# Altium schematic sheet Sheet1.SchDoc
size A3
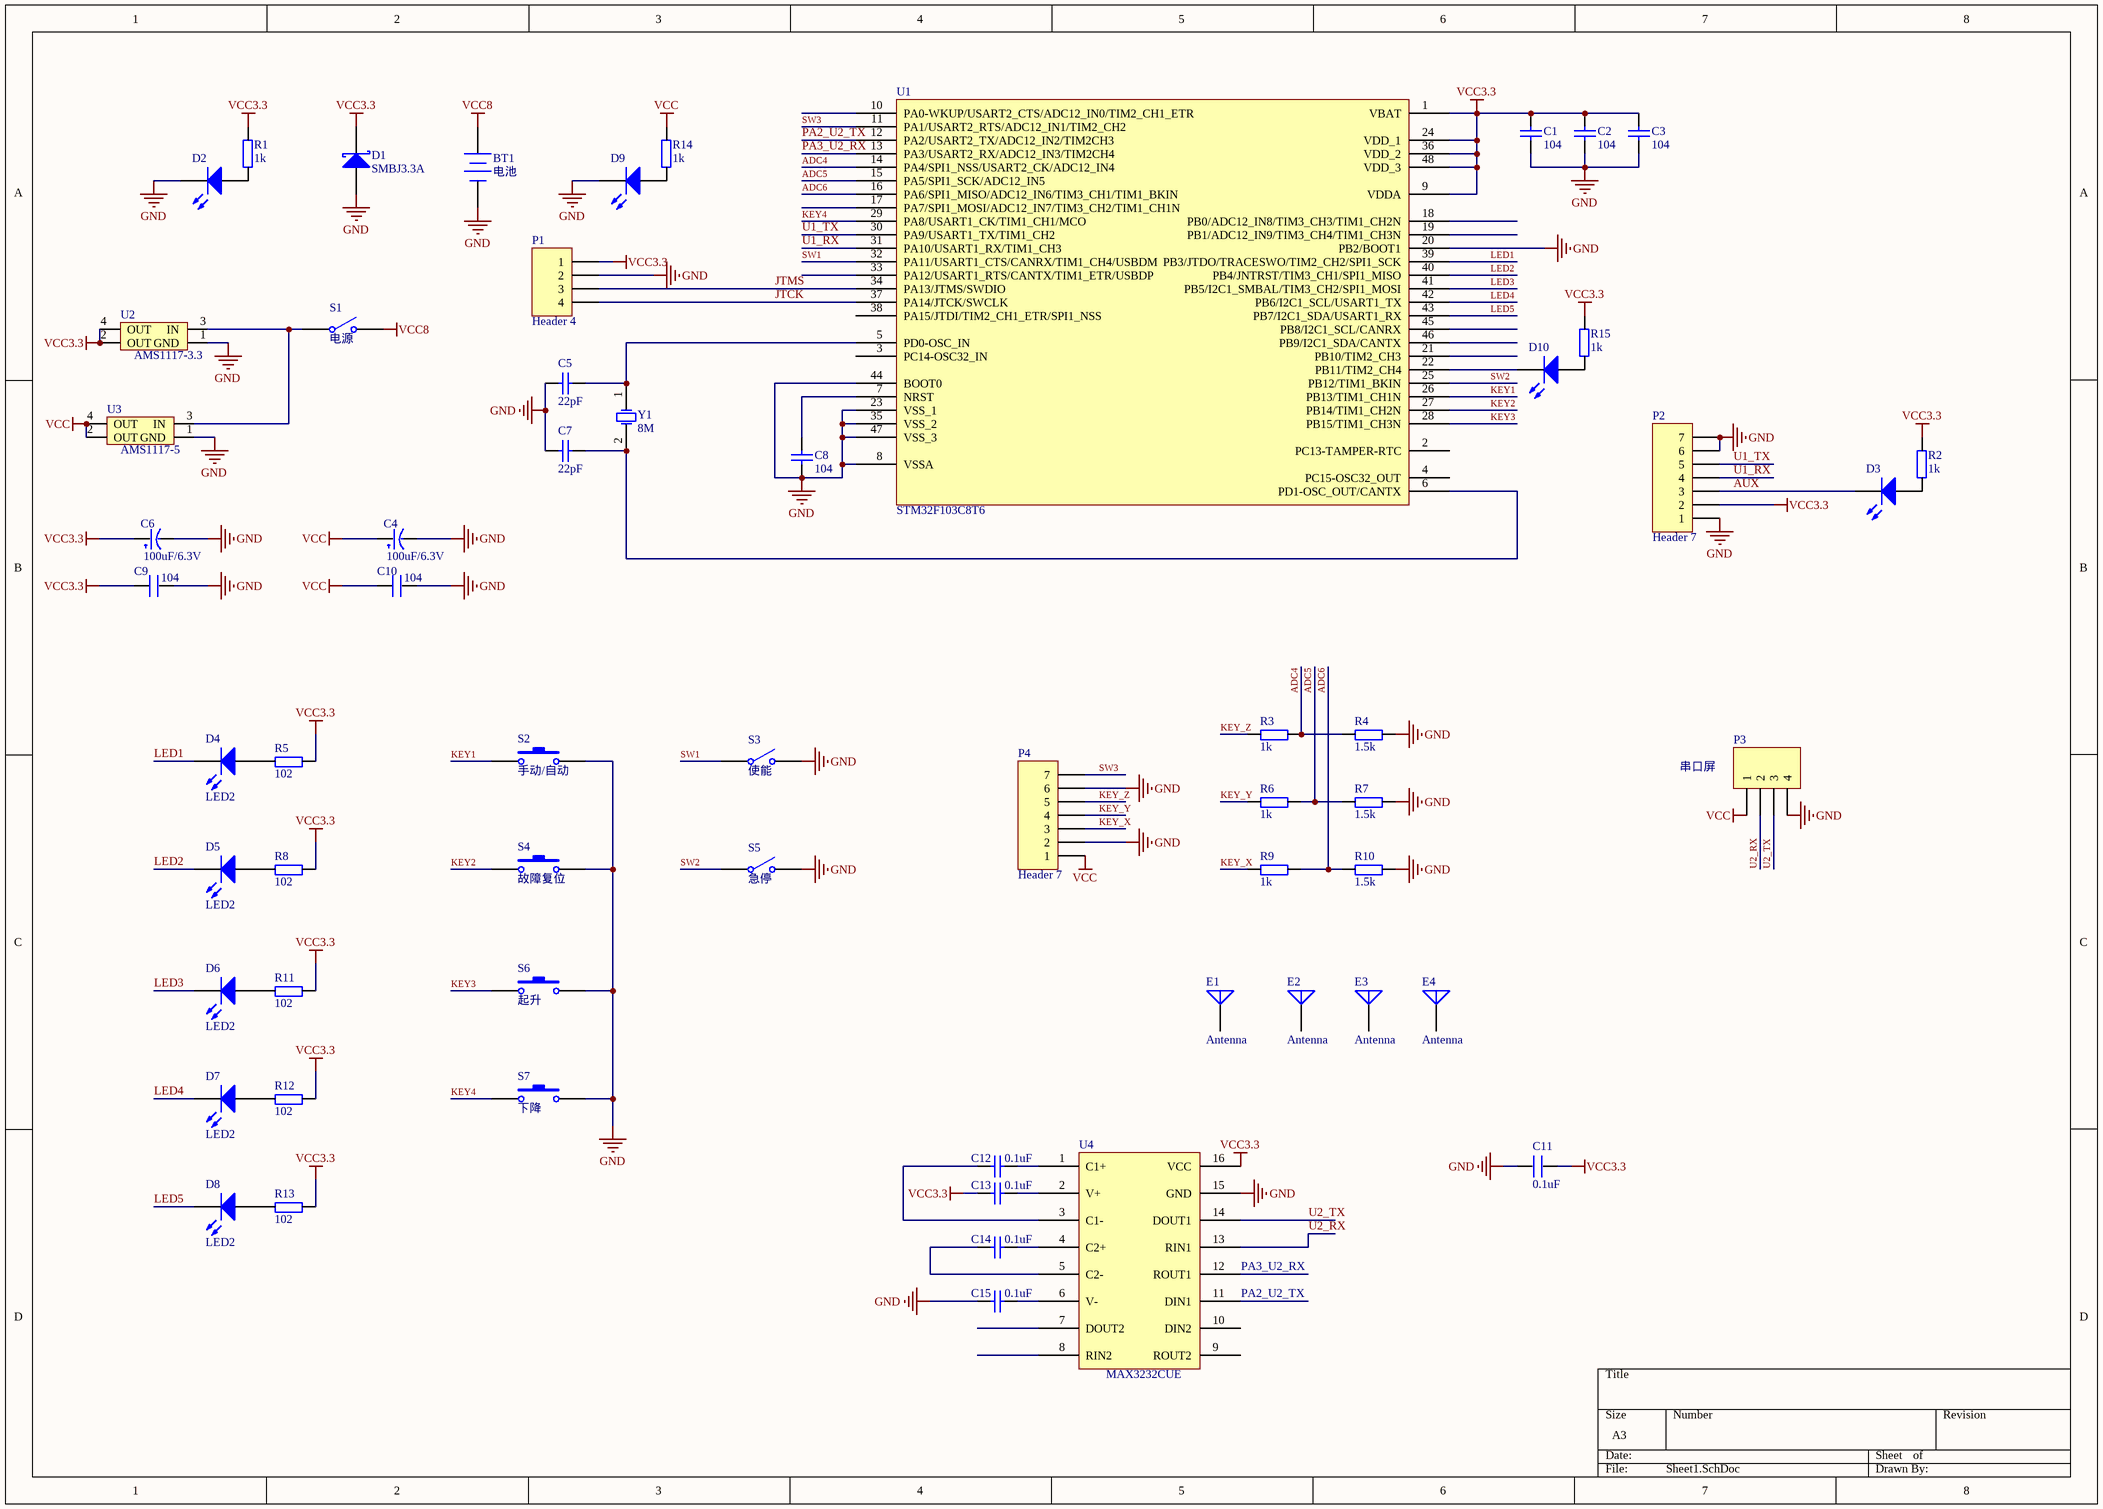
[diagram p0: Sheet1.SchDoc]

## Parts
BT1  电池  [KEY/SW]
C1  104  [0805_C]
C2  104  [0805_C]
C3  104  [0805_C]
C4  100uF/6.3V  [3216]
C5  22pF  [0805_C]
C6  100uF/6.3V  [3216]
C7  22pF  [0805_C]
C8  104  [0805_C]
C9  104  [0805_C]
C10  104  [0805_C]
C11  0.1uF  [0805_C]
C12  0.1uF  [0805_C]
C13  0.1uF  [0805_C]
C14  0.1uF  [0805_C]
C15  0.1uF  [0805_C]
D1  SMBJ3.3A  [SMB(DO-214AA)_S1]
D2  LED0  [LC-0805_LED_S1]  (value not drawn)
D3  LED0  [LC-0805_LED_S1]  (value not drawn)
D4  LED2  [LED1]
D5  LED2  [LED1]
D6  LED2  [LED1]
D7  LED2  [LED1]
D8  LED2  [LED1]
D9  LED0  [LC-0805_LED_S1]  (value not drawn)
D10  LED0  [LC-0805_LED_S1]  (value not drawn)
E1  Antenna  [定位孔 Φ3.2]
E2  Antenna  [定位孔 Φ3.2]
E3  Antenna  [定位孔 Φ3.2]
E4  Antenna  [定位孔 Φ3.2]
P1  Header 4  [IDE4]
P2  Header 7  [AS50-T27]
P3  串口屏  [IDE4]
P4  Header 7  [HDR1X7]
R1  1k  [0603_R]
R2  1k  [0603_R]
R3  1k  [0603_R]
R4  1.5k  [0603_R]
R5  102  [0603_R]
R6  1k  [0603_R]
R7  1.5k  [0603_R]
R8  102  [0603_R]
R9  1k  [0603_R]
R10  1.5k  [0603_R]
R11  102  [0603_R]
R12  102  [0603_R]
R13  102  [0603_R]
R14  1k  [0603_R]
R15  1k  [0603_R]
S1  电源  [KEY/SW]
S2  手动/自动  [KEY/SW]
S3  使能  [KEY/SW]
S4  故障复位  [KEY/SW]
S5  急停  [KEY/SW]
S6  起升  [KEY/SW]
S7  下降  [KEY/SW]
U1  STM32F103C8T6  [LQFP-48_7x7x05P]
U2  AMS1117-3.3  [LC-SOT-223]
U3  AMS1117-5  [LC-SOT-223]
U4  MAX3232CUE  [SO-16]
Y1  8M  [XTAL_US]

## Nets
GND: BT1.2(-) C1.2 C2.2 C3.2 C4.2(GND) C5.2 C6.2(GND) C7.2 C8.2 C9.1 C10.1 C11.1 C15.2 D1.2(A) D2.K D9.K P1.2 P2.1 P2.6 P2.7 P3.4 P4.2 P4.6 R4.2 R7.2 R10.2 S2.2 S3.2(NO) S4.2 S5.2(NO) S6.2 S7.2 U1.8(VSSA) U1.20(PB2/BOOT1) U1.23(VSS_1) U1.35(VSS_2) U1.44(BOOT0) U1.47(VSS_3) U2.1(GND) U3.1(GND) U4.15(GND)
VCC: C4.1(VCC) C10.2 P3.1 P4.1 R14.1 U3.2(OUT) U3.4(OUT)
VCC3.3: C1.1 C2.1 C3.1 C6.1(VCC) C9.2 C11.2 C13.2 D1.1(K) P1.1 P2.2 R1.1 R2.1 R5.2 R8.2 R11.2 R12.2 R13.2 R15.1 U1.1(VBAT) U1.9(VDDA) U1.24(VDD_1) U1.36(VDD_2) U1.48(VDD_3) U2.2(OUT) U2.4(OUT) U4.16(VCC)
VCC8: BT1.1(+) S1.2(NO)
ADC4: R3.2 R4.1 U1.14(PA4/SPI1_NSS/USART2_CK/ADC12_IN4)
ADC5: R6.2 R7.1 U1.15(PA5/SPI1_SCK/ADC12_IN5)
ADC6: R9.2 R10.1 U1.16(PA6/SPI1_MISO/ADC12_IN6/TIM3_CH1/TIM1_BKIN)
AUX: D3.K P2.3
JTCK: P1.4 U1.37(PA14/JTCK/SWCLK)
JTMS: P1.3 U1.34(PA13/JTMS/SWDIO)
KEY1: S2.1 U1.26(PB13/TIM1_CH1N)
KEY2: S4.1 U1.27(PB14/TIM1_CH2N)
KEY3: S6.1 U1.28(PB15/TIM1_CH3N)
KEY4: S7.1 U1.29(PA8/USART1_CK/TIM1_CH1/MCO)
KEY_X: P4.3 R9.1
KEY_Y: P4.4 R6.1
KEY_Z: P4.5 R3.1
LED1: D4.2(K) U1.39(PB3/JTDO/TRACESWO/TIM2_CH2/SPI1_SCK)
LED2: D5.2(K) U1.40(PB4/JNTRST/TIM3_CH1/SPI1_MISO)
LED3: D6.2(K) U1.41(PB5/I2C1_SMBAL/TIM3_CH2/SPI1_MOSI)
LED4: D7.2(K) U1.42(PB6/I2C1_SCL/USART1_TX)
LED5: D8.2(K) U1.43(PB7/I2C1_SDA/USART1_RX)
PA2_U2_TX: U1.12(PA2/USART2_TX/ADC12_IN2/TIM2CH3) U4.11(DIN1)
PA3_U2_RX: U1.13(PA3/USART2_RX/ADC12_IN3/TIM2CH4) U4.12(ROUT1)
SW1: S3.1(COMMON) U1.32(PA11/USART1_CTS/CANRX/TIM1_CH4/USBDM)
SW2: S5.1(COMMON) U1.25(PB12/TIM1_BKIN)
SW3: P4.7 U1.11(PA1/USART2_RTS/ADC12_IN1/TIM2_CH2)
U1_RX: P2.4 U1.31(PA10/USART1_RX/TIM1_CH3)
U1_TX: P2.5 U1.30(PA9/USART1_TX/TIM1_CH2)
U2_RX: P3.2 U4.13(RIN1)
U2_TX: P3.3 U4.14(DOUT1)
NetC5_1: C5.1 U1.5(PD0-OSC_IN) Y1.1(OSC1)
NetC7_1: C7.1 U1.6(PD1-OSC_OUT/CANTX) Y1.2(OSC2)
NetC8_1: C8.1 U1.7(NRST)
NetC12_1: C12.1 U4.1(C1+)
NetC12_2: C12.2 U4.3(C1-)
NetC13_1: C13.1 U4.2(V+)
NetC14_1: C14.1 U4.4(C2+)
NetC14_2: C14.2 U4.5(C2-)
NetC15_1: C15.1 U4.6(V-)
NetD2_A: D2.A R1.2
NetD3_A: D3.A R2.2
NetD4_1: D4.1(A) R5.1
NetD5_1: D5.1(A) R8.1
NetD6_1: D6.1(A) R11.1
NetD7_1: D7.1(A) R12.1
NetD8_1: D8.1(A) R13.1
NetD9_A: D9.A R14.2
NetD10_A: D10.A R15.2
NetD10_K: D10.K U1.22(PB11/TIM2_CH4)
NetS1_1: S1.1(COMMON) U2.3(IN) U3.3(IN)

Not connected (* = marked no-connect by the designer): E1 1(A); E2 1(A); E3 1(A); E4 1(A); U1 2(PC13-TAMPER-RTC) 3(PC14-OSC32_IN) 4(PC15-OSC32_OUT) 10(PA0-WKUP/USART2_CTS/ADC12_IN0/TIM2_CH1_ETR) 17(PA7/SPI1_MOSI/ADC12_IN7/TIM3_CH2/TIM1_CH1N) 18(PB0/ADC12_IN8/TIM3_CH3/TIM1_CH2N) 19(PB1/ADC12_IN9/TIM3_CH4/TIM1_CH3N) 21(PB10/TIM2_CH3) 33(PA12/USART1_RTS/CANTX/TIM1_ETR/USBDP) 38(PA15/JTDI/TIM2_CH1_ETR/SPI1_NSS) 45(PB8/I2C1_SCL/CANRX) 46(PB9/I2C1_SDA/CANTX); U4 7(DOUT2) 8(RIN2) 9(ROUT2) 10(DIN2)

## Library data of the parts
BT1 = Battery: Multicell Battery; Published: 24-Mar-1999; LatestRevisionDate: 17-Jul-2002; LatestRevisionNote: Re-released for DXP Platform.; PackageReference: BAT-2; Publisher: Altium Limited; PackageDescription: Battery; 2 Leads
C1-C3 C7 C8 C12-C15 = Cap: Capacitor; Published: 8-Jun-2000; LatestRevisionDate: 17-Jul-2002; LatestRevisionNote: Re-released for DXP Platform.; PackageReference: RAD-0.3; Publisher: Altium Limited; PackageDescription: Radial Cap, Thru-Hole; 2 Leads; 0.3 in Pin Spacing
  C1-C3 C8: Value: 104
  C7: Value: 22pF
  C12-C15: Value: 0.1uF
C4 C6 = CAP
C5 = Cap: Capacitor; Value: 22p; Published: 8-Jun-2000; LatestRevisionDate: 17-Jul-2002; LatestRevisionNote: Re-released for DXP Platform.; PackageReference: RAD-0.3; Publisher: Altium Limited; PackageDescription: Radial Cap, Thru-Hole; 2 Leads; 0.3 in Pin Spacing
C9 C10 = C
C11 = C_2
D1 = Diode 18TQ045: Schottky Rectifier; Note: Terminal 2 is the TAB and is electrically connected to the cathode; Published: 8-Jun-2000; LatestRevisionDate: 17-Jul-2002; LatestRevisionNote: Re-released for DXP Platform.; DatasheetVersion: Dec-1997; PackageVersion: Feb-1998; PackageReference: TO-220AC; Publisher: Altium Limited; PackageDescription: TO, Thru-Hole, Vertical, Heatsink Mounted; 3 In-Line Leads (1 Absent); Pitch 2.54 mm; ComponentLink1Description: Manufacturer Link; ComponentLink1URL: http://www.irf.com/; ComponentLink2Description: Datasheet; ComponentLink2URL: http://www.irf.com/product-info/datasheets/data/18tq.pdf
D2 D3 D9 D10 = LED0: Typical INFRARED GaAs LED; Published: 8-Jun-2000; LatestRevisionDate: 08-Jul-2005; LatestRevisionNote: Mech Layer 1 removed.; PackageReference: LED-0; Publisher: Altium Limited; PackageDescription: LED; 2 Leads
D4-D8 = LED2: Typical RED, GREEN, YELLOW, AMBER GaAs LED; Published: 8-Jun-2000; LatestRevisionDate: 17-Jul-2002; LatestRevisionNote: Re-released for DXP Platform.; PackageVersion: Feb-2002; PackageReference: 3.2X1.6X1.1; Publisher: Altium Limited; PackageDescription: SM LED; 2 Flat Leads
E1-E4 = Antenna: Generic Antenna; Published: 24-Mar-1999; LatestRevisionDate: 17-Jul-2002; LatestRevisionNote: Re-released for DXP Platform.; PackageReference: PIN1; Publisher: Altium Limited
P1 P3 = Header 4: Header, 4-Pin; LatestRevisionDate: 17-Jul-2002; LatestRevisionNote: Re-released for DXP Platform.; Publisher: Altium Limited
P2 P4 = Header 7: Header, 7-Pin; LatestRevisionDate: 17-Jul-2002; LatestRevisionNote: Re-released for DXP Platform.; Publisher: Altium Limited
R1-R15 = R_2
S1 S3 S5 = SW-SPST: Single-Pole, Single-Throw Switch; Published: 24-Mar-1999; LatestRevisionDate: 17-Jul-2002; LatestRevisionNote: Re-released for DXP Platform.; PackageReference: SPST-2; Publisher: Altium Limited; PackageDescription: Switch; 2 Leads
S2 S4 S6 S7 = SW-PB: Switch; Published: 24-Mar-1999; LatestRevisionDate: 17-Jul-2002; LatestRevisionNote: Re-released for DXP Platform.; PackageReference: SPST-2; Publisher: Altium Limited; PackageDescription: Switch; 2 Leads
U1 = stm32f103v8t6
U2 U3 = AMS1117
Y1 = XTAL: Crystal Oscillator; Published: 8-Jun-2000; LatestRevisionDate: 17-Jul-2002; LatestRevisionNote: Re-released for DXP Platform.; PackageReference: R38; Publisher: Altium Limited; PackageDescription: Crystal, Thru-Hole; 2 Leads; Body 3.1 x 8.2 mm (Dia.xH)